# Altium schematic sheet Sensor.SchDoc
size A4
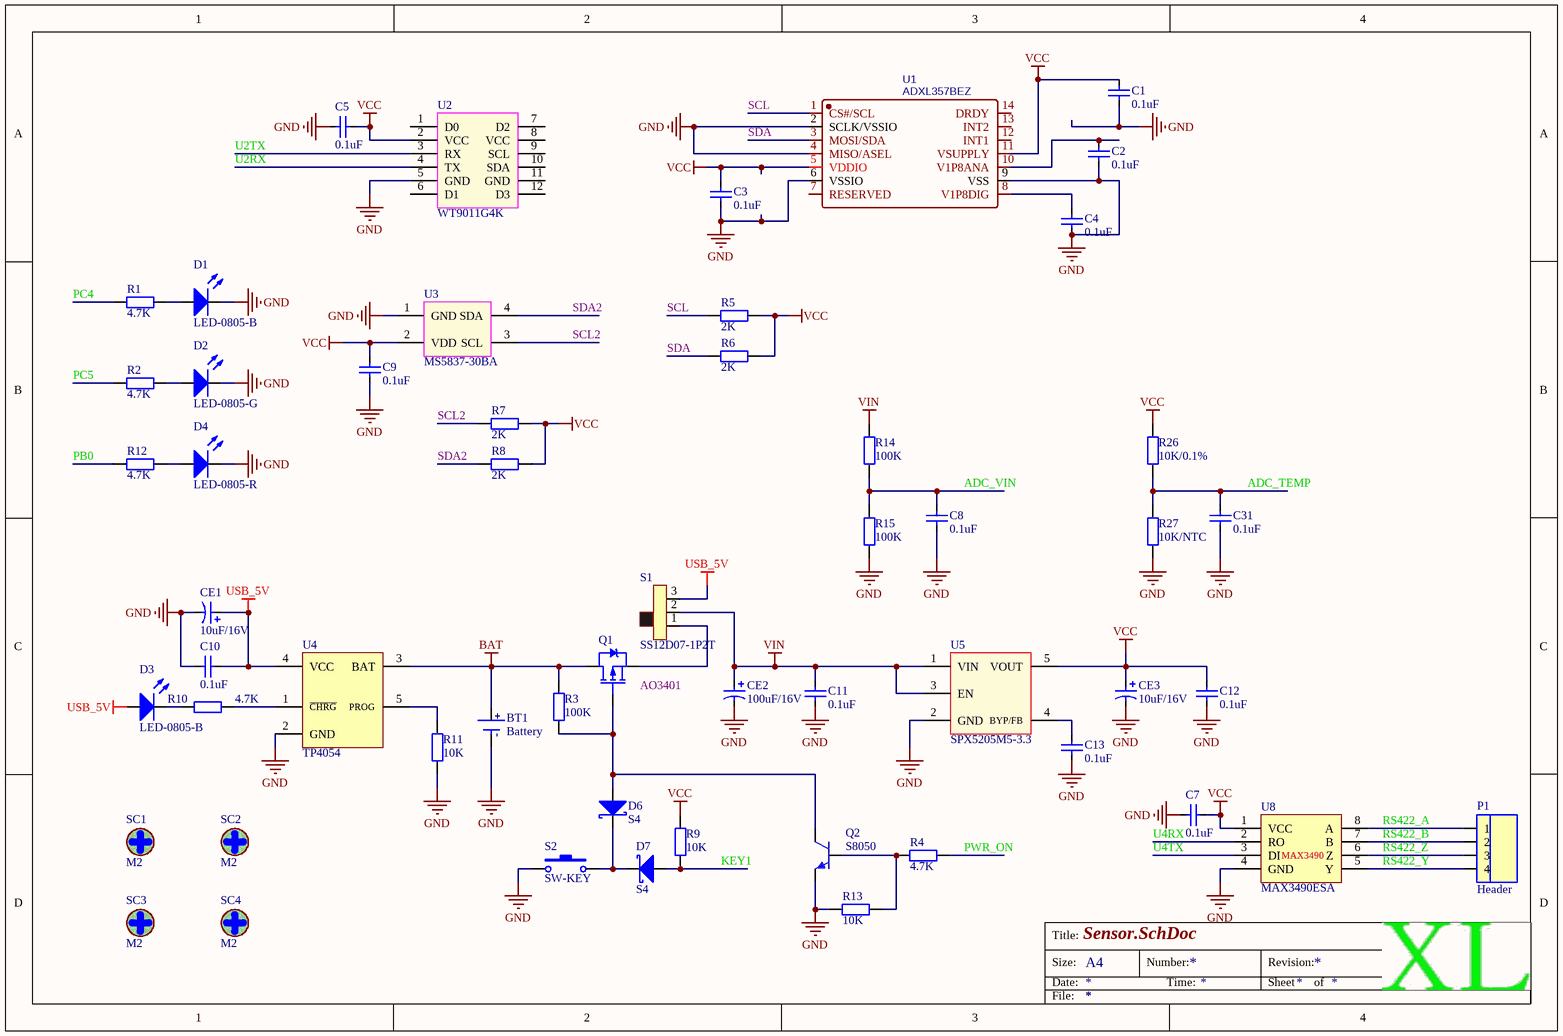
[diagram p0: Sensor.SchDoc]

## Parts
BT1  Battery  [BHDR2]
C1  value 0.1uF  [CAP_0603]  (hidden comment: Cap_0603)
C2  value 0.1uF  [CAP_0603]  (hidden comment: Cap_0603)
C3  value 0.1uF  [CAP_0603]  (hidden comment: Cap_0603)
C4  value 0.1uF  [CAP_0603]  (hidden comment: Cap_0603)
C5  value 0.1uF  [CAP_0603]  (hidden comment: Cap_0603)
C7  value 0.1uF  [CAP_0603]  (hidden comment: Cap_0603)
C8  value 0.1uF  [CAP_0603]  (hidden comment: Cap_0603)
C9  value 0.1uF  [CAP_0603]  (hidden comment: Cap_0603)
C10  value 0.1uF  [CAP_0603]  (hidden comment: Cap_0603)
C11  value 0.1uF  [CAP_0603]  (hidden comment: Cap_0603)
C12  value 0.1uF  [CAP_0603]  (hidden comment: Cap_0603)
C13  value 0.1uF  [CAP_0603]  (hidden comment: Cap_0603)
C31  value 0.1uF  [CAP_0603]  (hidden comment: Cap_0603)
CE1  value 10uF/16V  [CAP_ELEC_AL_4x5]  (hidden comment: CAP POL)
CE2  value 100uF/16V  [CAP_ELEC_AL_6.3x4.2]  (hidden comment: CAP POL)
CE3  value 10uF/16V  [CAP_ELEC_AL_4x5]  (hidden comment: CAP POL)
D1  value LED-0805-B  [LED_0805_B]  (hidden comment: LED_0805)
D2  value LED-0805-G  [LED_0805_G]  (hidden comment: LED_0805)
D3  value LED-0805-B  [LED_0805_B]  (hidden comment: LED_0805)
D4  value LED-0805-R  [LED_0805_R]  (hidden comment: LED_0805)
D6  S4  [SOD323]
D7  S4  [SOD323]
P1  Header  [BHDR4]
Q1  AO3401  [SOT-23-XL]
Q2  S8050  [SOT-23-XL]
R1  value 4.7K  [RES_0603]  (hidden comment: Res_0603)
R2  value 4.7K  [RES_0603]  (hidden comment: Res_0603)
R3  value 100K  [RES_0603]  (hidden comment: Res_0603)
R4  value 4.7K  [RES_0603]  (hidden comment: Res_0603)
R5  value 2K  [RES_0603]  (hidden comment: Res_0603)
R6  value 2K  [RES_0603]  (hidden comment: Res_0603)
R7  value 2K  [RES_0603]  (hidden comment: Res_0603)
R8  value 2K  [RES_0603]  (hidden comment: Res_0603)
R9  value 10K  [RES_0603]  (hidden comment: Res_0603)
R10  value 4.7K  [RES_0603]  (hidden comment: Res_0603)
R11  value 10K  [RES_0603]  (hidden comment: Res_0603)
R12  value 4.7K  [RES_0603]  (hidden comment: Res_0603)
R13  value 10K  [RES_0603]  (hidden comment: Res_0603)
R14  value 100K  [RES_0603]  (hidden comment: Res_0603)
R15  value 100K  [RES_0603]  (hidden comment: Res_0603)
R26  value 10K/0.1%  [RES_0805]  (hidden comment: Res_0805)
R27  value 10K/NTC  [NTC-MF52]  (hidden comment: Res_0603)
S1  SS12D07-1P2T  [SS12D07-XL]
S2  SW-KEY  [KEY4-180-XL]
SC1  M2  [MARK-2.0MM]
SC2  M2  [MARK-2.0MM]
SC3  M2  [MARK-2.0MM]
SC4  M2  [MARK-2.0MM]
U1  ADXL357BEZ  [LCC-14_L6.0-W6.0-P1.27-TL]
U2  WT9011G4K  [WT9011G4K]
U3  MS5837-30BA  [MS5837]
U4  TP4054  [SOT-23-5]
U5  value SPX5205M5-3.3  [SOT23-5]  (hidden comment: SPX5205M-L-3-3)
U8  MAX3490ESA  [SOP8-XL]

## Nets
BAT: BT1.1(+) Q1.3(D) R3.2 U4.3(BAT)
GND: BT1.2(-) C1.1 C2.1 C3.1 C4.1 C5.2 C7.2 C8.1 C9.1 C10.2 C11.1 C12.1 C13.1 C31.1 CE1.2 CE2.2 CE3.2 D1.2(K) D2.2(K) D4.2(K) Q2.2(E) R11.1 R13.2 R15.1 R27.1 S2.1 U1.2(SCLK/VSSIO) U1.4(MISO/ASEL) U1.6(VSSIO) U1.9(VSS) U2.5(GND) U3.1(GND) U4.2(GND) U5.2(GND) U8.4(GND)
PE: SC1.0(PE) SC2.0(PE) SC3.0(PE) SC4.0(PE)
USB_5V: C10.1 CE1.1 D3.1(A) S1.3(S3) U4.4(VCC)
VCC: C1.2 C3.2 C5.1 C7.1 C9.2 C12.2 CE3.1 R5.2 R6.2 R7.2 R8.2 R9.2 R26.2 U1.5(VDDIO) U1.11(VSUPPLY) U2.2(VCC) U3.2(VDD) U5.5(VOUT) U8.1(VCC)
VIN: C11.2 CE2.1 R14.2 S1.2(S2) U5.1(VIN) U5.3(EN)
ADC_TEMP: C31.2 R26.1 R27.2
ADC_VIN: C8.2 R14.1 R15.2
KEY1: D7.1(A) R9.1
PB0: R12.1
PC4: R1.1
PC5: R2.1
PWR_ON: R4.1
RS422_A: P1.1 U8.8(A)
RS422_B: P1.2 U8.7(B)
RS422_Y: P1.4 U8.5(Y)
RS422_Z: P1.3 U8.6(Z)
SCL: R5.1 U1.1(CS#/SCL)
SCL2: R7.1 U3.3(SCL)
SDA: R6.1 U1.3(MOSI/SDA)
SDA2: R8.1 U3.4(SDA)
U2RX: U2.4(TX)
U2TX: U2.3(RX)
U4RX: U8.2(RO)
U4TX: U8.3(DI)
NetC2_2: C2.2 U1.10(V1P8ANA)
NetC4_2: C4.2 U1.8(V1P8DIG)
NetC13_2: C13.2 U5.4(BYP/FB)
NetD1_1: D1.1(A) R1.2
NetD2_1: D2.1(A) R2.2
NetD3_2: D3.2(K) R10.2
NetD4_1: D4.1(A) R12.2
NetD6_1: D6.1(A) Q1.1(G) Q2.3(C) R3.1
NetD6_2: D6.2(K) D7.2(K) S2.2
NetQ1_2: Q1.2(S) S1.1(S1)
NetQ2_1: Q2.1(B) R4.2 R13.1
NetR10_1: R10.1 U4.1(~{CHRG})
NetR11_2: R11.2 U4.5(PROG)

Not connected (* = marked no-connect by the designer): U1 7(RESERVED) 12(INT1) 13(INT2) 14(DRDY); U2 1(D0) 6(D1) 7(D2) 8(VCC) 9(SCL) 10(SDA) 11(GND) 12(D3)

## Notes on the sheet
- Title:
- Size:
- Date:
- A4
- Number:
- Time:
- Revision:
- Sheet
- of
- File:

## Library data of the parts
BT1 = Battery1: Multicell Battery; Published: 24-Mar-1999; LatestRevisionDate: 17-Jul-2002; LatestRevisionNote: Re-released for DXP Platform.; PackageReference: BAT-2; Publisher: Altium Limited
C1-C5 C7-C13 C31 = Cap_0603: Capacitor
CE1-CE3 = CAP POL: 电解电容
D1-D4 = LED_0805: LED
D6 D7 = S4: 1N5819,Low-power general purpose voltageregulator diodes in a small plasticSMD SOD323 package; Value: S4
P1 = Header 4: Header, 2-Pin; LatestRevisionDate: 17-Jul-2002; LatestRevisionNote: Re-released for DXP Platform.; Publisher: Altium Limited
Q1 = AO3401: PMOS,SOT23,-30V,3A; Value: AO3401
Q2 = S8050: NPN; Value: S8050
R1-R15 R27 = Res_0603: Resistor
R26 = Res_0805: Resistor
S1 = SS12D07: SW,SS12D07; Value: SS12D07
S2 = SW-KEY: Switch; Published: 24-Mar-1999; LatestRevisionDate: 17-Jul-2002; LatestRevisionNote: Re-released for DXP Platform.; PackageReference: SPST-2; Publisher: Altium Limited; PackageDescription: Switch; 2 Leads
SC1-SC4 = Screw_M3: Screw M3, MARK; Value: M3
U1 = ADXL357BEZ: BOM_Manufacturer: Analog Devices; Contributor: LCSC; BOM_Supplier: LCSC; BOM_Supplier Part: C579462; BOM_Manufacturer Part: ADXL357BEZ; BOM_JLCPCB Part Class: Extended Part; spicePre: U; spiceSymbolName: ADXL357BEZ
U5 = SPX5205M-L-3-3: LDO,RC33
U8 = MAX3490: RS422; Value: MAX3490ESA
U2 = WT9011G4K: Value: *
U4 = TP4054: Value: TP4054